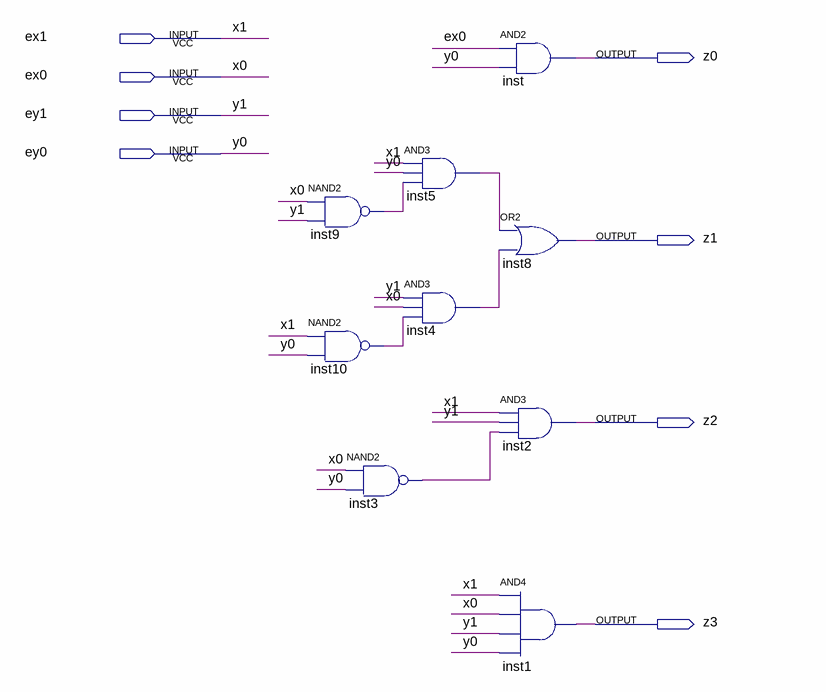
[diagram p0: schematic sheet]
// Quartus schematic multiplicador2bitsBSS.bdf as structural Verilog: 9 symbols, 8 pins
module multiplicador2bitsBSS (
  input  ex1,
  input  ex0,
  input  ey1,
  input  ey0,
  output z0,
  output z1,
  output z2,
  output z3
);

  wire inst3_out, inst4_out, inst5_out, inst9_out, inst10_out;

  nand inst9 (inst9_out, ex0, ey1);
  nand inst10 (inst10_out, ex1, ey0);
  and inst5 (inst5_out, ex1, ey0, inst9_out);
  and inst4 (inst4_out, ey1, ex0, inst10_out);
  nand inst3 (inst3_out, ex0, ey0);
  and inst (z0, ex0, ey0);
  or inst8 (z1, inst5_out, inst4_out);
  and inst2 (z2, ex1, ey1, inst3_out);
  and inst1 (z3, ex1, ex0, ey1, ey0);

  // Other names for the same wires on the sheet: x0 = ex0; x1 = ex1; y0 = ey0; y1 = ey1
endmodule
